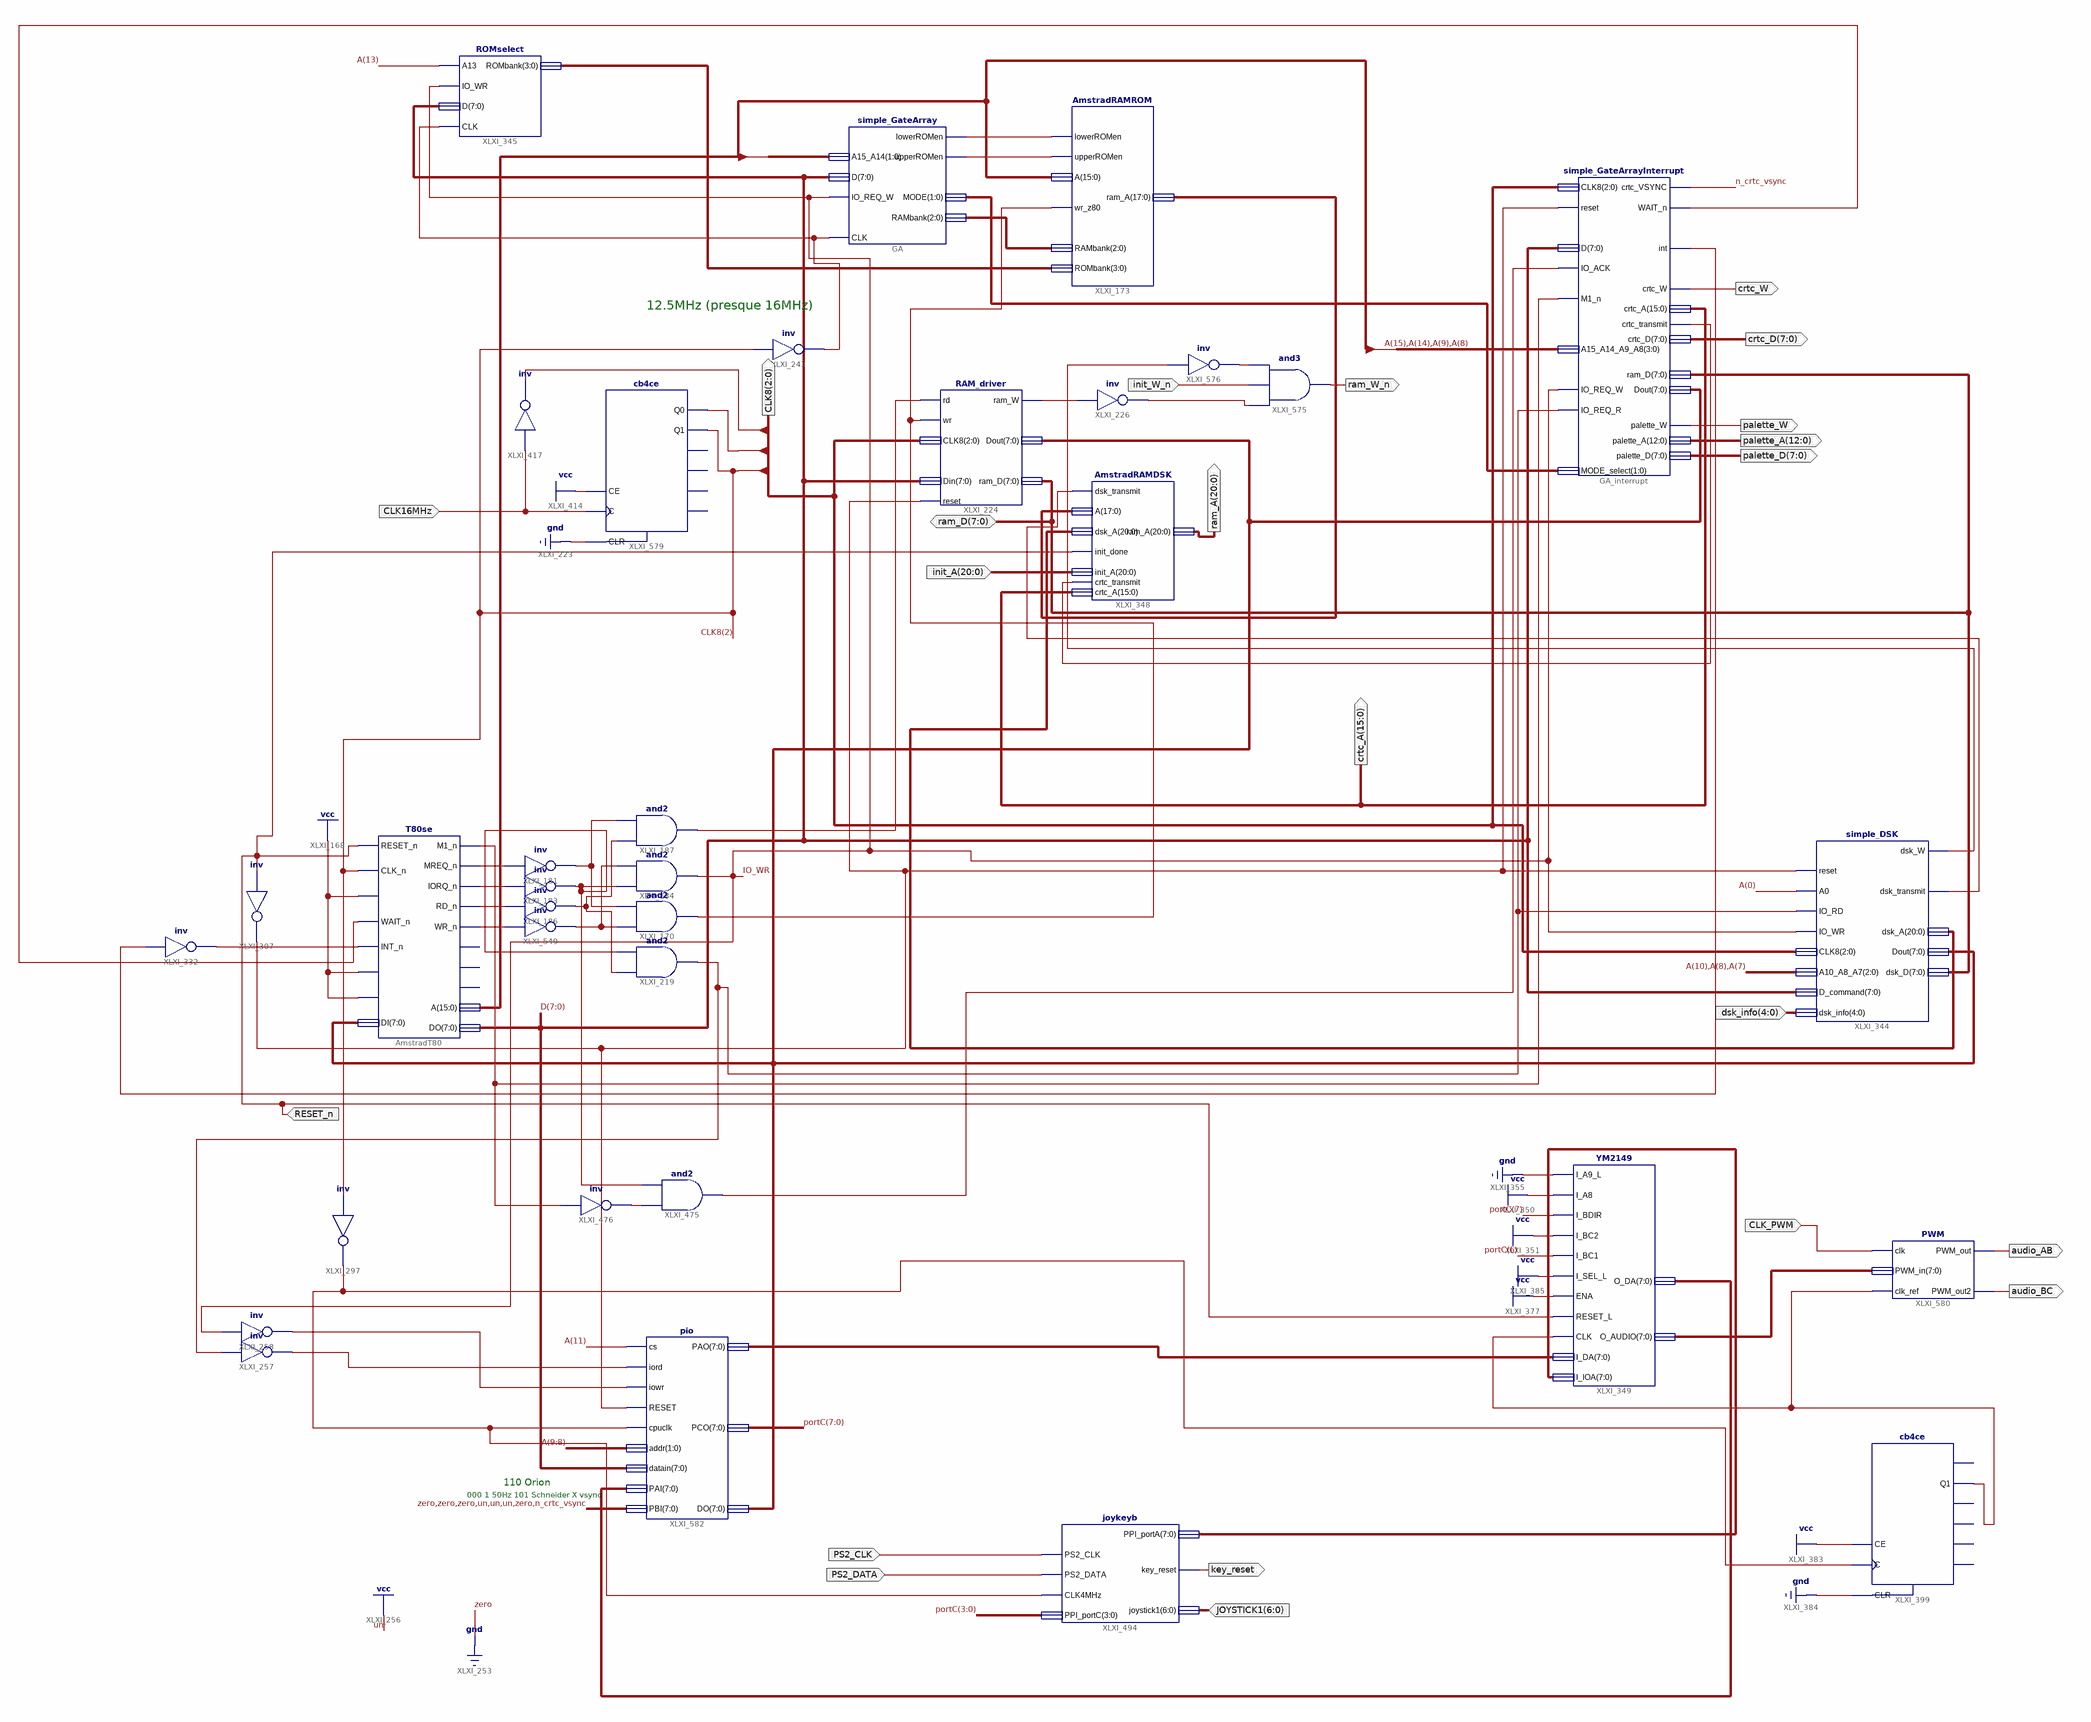
[diagram p0: schematic sheet 1]
// Xilinx ISE schematic amstrad_motherboard.sch (spartan6) as structural Verilog: 34 symbols, 22 ports
module amstrad_motherboard (
  input  [20:0] init_A,
  input  init_W_n,
  input  CLK16MHz,
  input  PS2_CLK,
  input  PS2_DATA,
  input  RESET_n,
  input  [6:0] JOYSTICK1,
  input  CLK_PWM,
  input  [4:0] dsk_info,
  inout  [7:0] ram_D,
  output [2:0] CLK8,
  output [20:0] ram_A,
  output [15:0] crtc_A,
  output crtc_W,
  output ram_W_n,
  output [7:0] crtc_D,
  output palette_W,
  output [12:0] palette_A,
  output [7:0] palette_D,
  output key_reset,
  output audio_AB,
  output audio_BC
);

  wire IO_RD, IO_REQ, IO_WR, LED1, LED2, MEM_RD, MEM_WR, n_crtc_vsync, XLXN_38, XLXN_58, XLXN_75, XLXN_86,
       XLXN_180, XLXN_435, XLXN_555, XLXN_556, XLXN_621, XLXN_633, XLXN_785, XLXN_786, XLXN_787, XLXN_806,
       XLXN_814, XLXN_824, XLXN_826, XLXN_835, XLXN_845, XLXN_848, XLXN_849, XLXN_852, XLXN_858, XLXN_862,
       XLXN_864;
  wire [1:0] XLXN_857;
  wire [2:0] RAMBank;
  wire [3:0] ROMbank;
  wire [7:0] D, portC, XLXN_283, XLXN_462, XLXN_518, XLXN_519, XLXN_861;
  wire [15:0] A;
  wire [17:0] vram_A;
  wire [20:0] XLXN_427;

  simple_GateArray GA (
    .CLK(XLXN_435), .IO_REQ_W(IO_WR), .A15_A14(A[15:14]), .D(D), .lowerROMen(LED1), .upperROMen(LED2),
    .MODE(XLXN_857), .RAMbank(RAMBank));
  AmstradRAMROM XLXI_173 (
    .wr_z80(MEM_WR), .lowerROMen(LED1), .upperROMen(LED2), .A(A), .RAMbank(RAMBank), .ROMbank(ROMbank),
    .ram_A(vram_A));
  not XLXI_243 (XLXN_435, CLK8[2]);
  not XLXI_226 (XLXN_556, XLXN_555);
  AmstradRAMDSK XLXI_348 (
    .dsk_transmit(XLXN_621), .crtc_transmit(XLXN_852), .init_done(RESET_n), .A(vram_A), .dsk_A(XLXN_427),
    .init_A(init_A), .crtc_A(crtc_A), .ram_A(ram_A));
  ROMselect XLXI_345 (.CLK(XLXN_435), .A13(A[13]), .IO_WR(IO_WR), .D(D), .ROMbank(ROMbank));
  RAM_driver XLXI_224 (
    .rd(MEM_RD), .wr(MEM_WR), .reset(XLXN_858), .CLK8(CLK8), .Din(D), .Dout(XLXN_283), .ram_D(ram_D),
    .ram_W(XLXN_555));
  not XLXI_183 (IO_REQ, XLXN_75);
  and XLXI_184 (IO_WR, IO_REQ, XLXN_785);
  and XLXI_170 (MEM_WR, XLXN_785, XLXN_786);
  not XLXI_186 (XLXN_787, XLXN_86);
  and XLXI_187 (MEM_RD, XLXN_787, XLXN_786);
  and XLXI_219 (IO_RD, XLXN_787, IO_REQ);
  not XLXI_257 (XLXN_864, IO_RD);
  not XLXI_258 (XLXN_180, IO_WR);
  not XLXI_297 (XLXN_633, CLK8[2]);
  simple_DSK XLXI_344 (
    .reset(XLXN_858), .A0(A[0]), .IO_RD(IO_RD), .IO_WR(IO_WR), .CLK8(CLK8), .A10_A8_A7({A[10], A[8:7]}),
    .D_command(D), .dsk_info(dsk_info), .Dout(XLXN_283), .dsk_D(ram_D), .dsk_W(XLXN_849),
    .dsk_transmit(XLXN_621), .dsk_A(XLXN_427));
  not XLXI_332 (XLXN_814, XLXN_835);
  YM2149 XLXI_349 (
    .I_A9_L(1'b0), .I_A8(1'b1), .I_BDIR(portC[7]), .I_BC2(1'b1), .I_BC1(portC[6]), .I_SEL_L(1'b1),
    .ENA(1'b1), .RESET_L(RESET_n), .CLK(XLXN_862), .I_DA(XLXN_462), .I_IOA(XLXN_518), .O_DA(XLXN_519),
    .O_AUDIO(XLXN_861));
  cb4ce XLXI_399 (.C(XLXN_633), .CE(1'b1), .CLR(1'b0), .Q1(XLXN_862));  // open: CEO, Q0, Q2, Q3, TC
  not XLXI_181 (XLXN_786, XLXN_58);
  not XLXI_549 (XLXN_785, XLXN_38);
  not XLXI_476 (XLXN_824, XLXN_845);
  not XLXI_307 (XLXN_858, RESET_n);
  joykeyb XLXI_494 (
    .PS2_CLK(PS2_CLK), .PS2_DATA(PS2_DATA), .CLK4MHz(XLXN_633), .PPI_portC(portC[3:0]),
    .joystick1(JOYSTICK1), .PPI_portA(XLXN_518), .key_reset(key_reset));
  and XLXI_475 (XLXN_826, XLXN_824, IO_REQ);
  and XLXI_575 (ram_W_n, XLXN_556, init_W_n, XLXN_848);
  not XLXI_576 (XLXN_848, XLXN_849);
  simple_GateArrayInterrupt GA_interrupt (
    .IO_REQ_W(IO_WR), .IO_REQ_R(IO_RD), .IO_ACK(XLXN_826), .M1_n(XLXN_845), .reset(XLXN_858), .CLK8(CLK8),
    .A15_A14_A9_A8({A[15:14], A[9:8]}), .MODE_select(XLXN_857), .D(D), .Dout(XLXN_283), .ram_D(ram_D),
    .crtc_VSYNC(n_crtc_vsync), .crtc_W(crtc_W), .crtc_transmit(XLXN_852), .\int (XLXN_835),
    .WAIT_n(XLXN_806), .palette_W(palette_W), .crtc_A(crtc_A), .crtc_D(crtc_D), .palette_A(palette_A),
    .palette_D(palette_D));
  not XLXI_417 (CLK8[0], CLK16MHz);
  cb4ce XLXI_579 (.C(CLK16MHz), .CE(1'b1), .CLR(1'b0), .Q0(CLK8[1]), .Q1(CLK8[2]));  // open: CEO, Q2, Q3, TC
  PWM XLXI_580 (.clk(CLK_PWM), .clk_ref(XLXN_862), .PWM_in(XLXN_861), .PWM_out(audio_AB), .PWM_out2(audio_BC));
  T80se AmstradT80 (
    .RESET_n(RESET_n), .CLK_n(CLK8[2]), .CLKEN(1'b1), .WAIT_n(XLXN_806), .INT_n(XLXN_814), .NMI_n(1'b1),
    .BUSRQ_n(1'b1), .DI(XLXN_283), .M1_n(XLXN_845), .MREQ_n(XLXN_58), .IORQ_n(XLXN_75), .RD_n(XLXN_86),
    .WR_n(XLXN_38), .A(A), .DO(D));  // open: RFSH_n, HALT_n, BUSAK_n
  pio XLXI_582 (
    .iowr(XLXN_180), .cpuclk(XLXN_633), .addr(A[9:8]), .datain(D), .PAO(XLXN_462), .PCO(portC),
    .DO(XLXN_283), .cs(A[11]), .iord(XLXN_864), .RESET(XLXN_858), .PBI({7'b0001110, n_crtc_vsync}),
    .PAI(XLXN_519));

  // Notes on the sheet:
  //   12.5MHz (presque 16MHz)
  //   110 Orion
  //   000 1 50Hz 101 Schneider X vsync
endmodule
